# Altium schematic sheet LED_Controler.SchDoc: LED Shield - LED controllers
size A4; DrawnBy: Bronson Philippa; Revision: 1; SheetNumber: 2; SheetTotal: 2
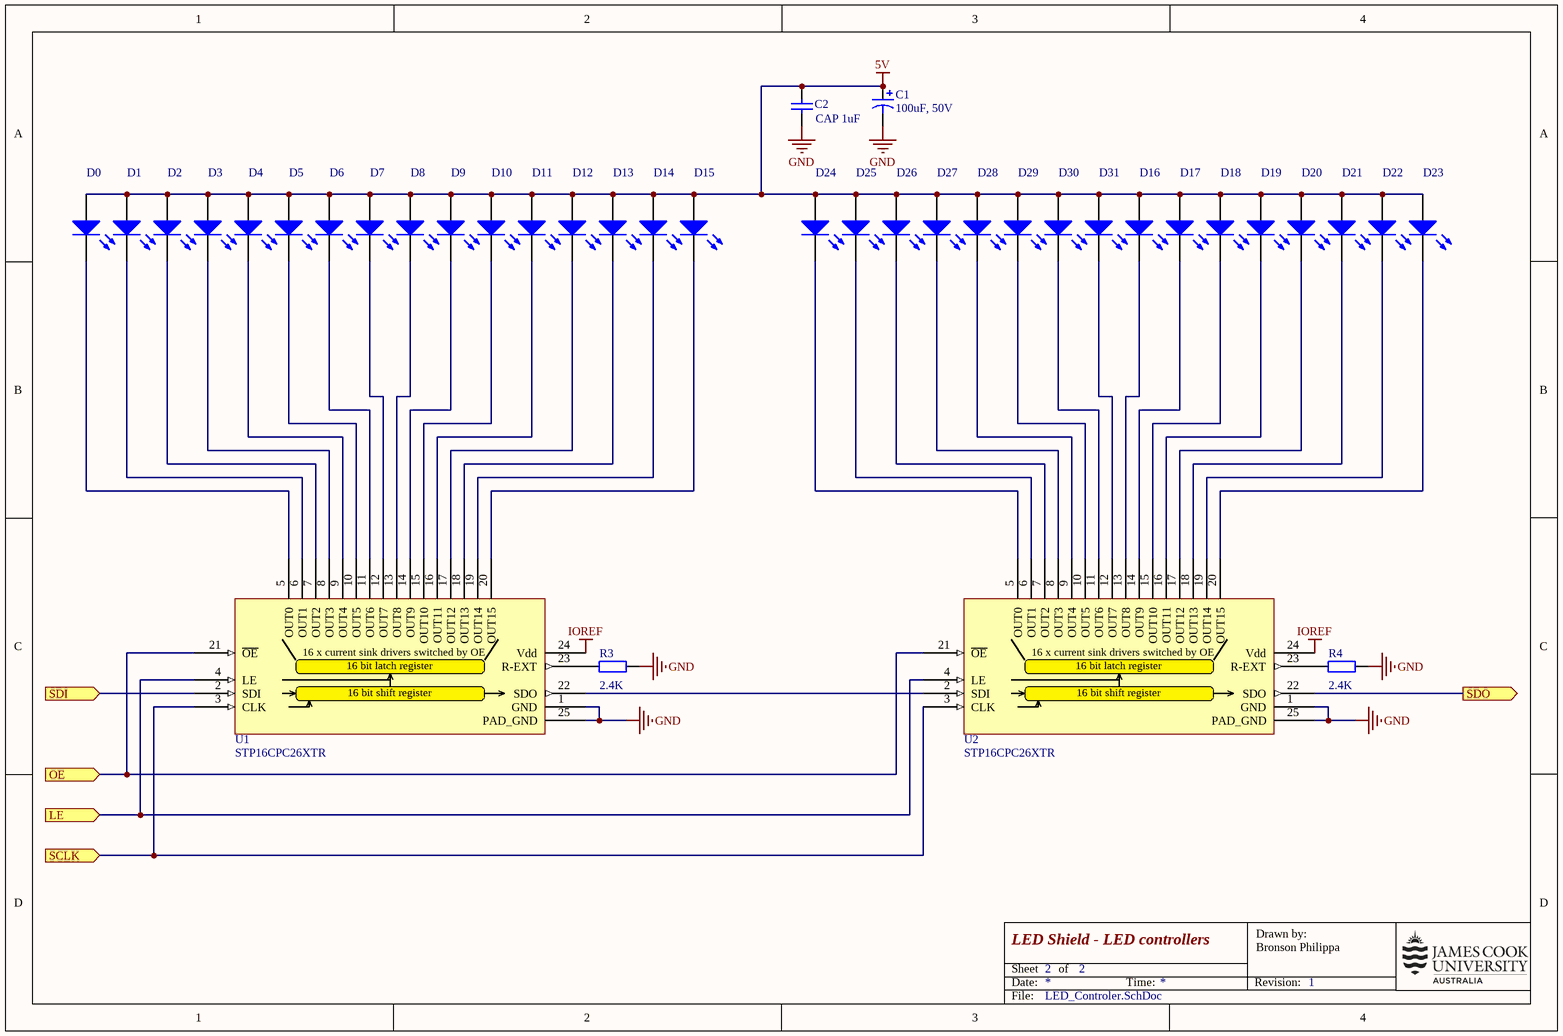
[diagram p0: LED_Controler.SchDoc]

## Parts
C1  100uF, 50V  [Capacitor radial 8mm]
C2  CAP 1uF  [CAPC1206(3216)130_M]
D0  LED3  [3.5X2.8X1.9]  (value not drawn)
D1  LED3  [3.5X2.8X1.9]  (value not drawn)
D2  LED3  [3.5X2.8X1.9]  (value not drawn)
D3  LED3  [3.5X2.8X1.9]  (value not drawn)
D4  LED3  [3.5X2.8X1.9]  (value not drawn)
D5  LED3  [3.5X2.8X1.9]  (value not drawn)
D6  LED3  [3.5X2.8X1.9]  (value not drawn)
D7  LED3  [3.5X2.8X1.9]  (value not drawn)
D8  LED3  [3.5X2.8X1.9]  (value not drawn)
D9  LED3  [3.5X2.8X1.9]  (value not drawn)
D10  LED3  [3.5X2.8X1.9]  (value not drawn)
D11  LED3  [3.5X2.8X1.9]  (value not drawn)
D12  LED3  [3.5X2.8X1.9]  (value not drawn)
D13  LED3  [3.5X2.8X1.9]  (value not drawn)
D14  LED3  [3.5X2.8X1.9]  (value not drawn)
D15  LED3  [3.5X2.8X1.9]  (value not drawn)
D16  LED3  [3.5X2.8X1.9]  (value not drawn)
D17  LED3  [3.5X2.8X1.9]  (value not drawn)
D18  LED3  [3.5X2.8X1.9]  (value not drawn)
D19  LED3  [3.5X2.8X1.9]  (value not drawn)
D20  LED3  [3.5X2.8X1.9]  (value not drawn)
D21  LED3  [3.5X2.8X1.9]  (value not drawn)
D22  LED3  [3.5X2.8X1.9]  (value not drawn)
D23  LED3  [3.5X2.8X1.9]  (value not drawn)
D24  LED3  [3.5X2.8X1.9]  (value not drawn)
D25  LED3  [3.5X2.8X1.9]  (value not drawn)
D26  LED3  [3.5X2.8X1.9]  (value not drawn)
D27  LED3  [3.5X2.8X1.9]  (value not drawn)
D28  LED3  [3.5X2.8X1.9]  (value not drawn)
D29  LED3  [3.5X2.8X1.9]  (value not drawn)
D30  LED3  [3.5X2.8X1.9]  (value not drawn)
D31  LED3  [3.5X2.8X1.9]  (value not drawn)
R3  value 2.4K  [AXIAL-0.4]  (hidden comment: Res2)
R4  value 2.4K  [AXIAL-0.4]  (hidden comment: Res2)
U1  STP16CPC26XTR  [STP16CPC26XTR TSSOP-24]
U2  STP16CPC26XTR  [STP16CPC26XTR TSSOP-24]

## Ports
LE (in), OE (in), SCLK (in), SDI (in), SDO (out)

## Nets
5V: C1.1 C2.1 D0.1(A) D1.1(A) D2.1(A) D3.1(A) D4.1(A) D5.1(A) D6.1(A) D7.1(A) D8.1(A) D9.1(A) D10.1(A) D11.1(A) D12.1(A) D13.1(A) D14.1(A) D15.1(A) D16.1(A) D17.1(A) D18.1(A) D19.1(A) D20.1(A) D21.1(A) D22.1(A) D23.1(A) D24.1(A) D25.1(A) D26.1(A) D27.1(A) D28.1(A) D29.1(A) D30.1(A) D31.1(A)
GND: C1.2 C2.2 R3.2 R4.2 U1.1(GND) U1.25(PAD_GND) U2.1(GND) U2.25(PAD_GND)
IOREF: U1.24(Vdd) U2.24(Vdd)
LE: U1.4(LE) U2.4(LE) ; port LE
OE: U1.21(~{OE}) U2.21(~{OE}) ; port OE
SCLK: U1.3(CLK) U2.3(CLK) ; port SCLK
SDI: U1.2(SDI) ; port SDI
SDO: U2.22(SDO) ; port SDO
NetD0_2: D0.2(K) U1.5(OUT0)
NetD1_2: D1.2(K) U1.6(OUT1)
NetD2_2: D2.2(K) U1.7(OUT2)
NetD3_2: D3.2(K) U1.8(OUT3)
NetD4_2: D4.2(K) U1.9(OUT4)
NetD5_2: D5.2(K) U1.10(OUT5)
NetD6_2: D6.2(K) U1.11(OUT6)
NetD7_2: D7.2(K) U1.12(OUT7)
NetD8_2: D8.2(K) U1.13(OUT8)
NetD9_2: D9.2(K) U1.14(OUT9)
NetD10_2: D10.2(K) U1.15(OUT10)
NetD11_2: D11.2(K) U1.16(OUT11)
NetD12_2: D12.2(K) U1.17(OUT12)
NetD13_2: D13.2(K) U1.18(OUT13)
NetD14_2: D14.2(K) U1.19(OUT14)
NetD15_2: D15.2(K) U1.20(OUT15)
NetD16_2: D16.2(K) U2.13(OUT8)
NetD17_2: D17.2(K) U2.14(OUT9)
NetD18_2: D18.2(K) U2.15(OUT10)
NetD19_2: D19.2(K) U2.16(OUT11)
NetD20_2: D20.2(K) U2.17(OUT12)
NetD21_2: D21.2(K) U2.18(OUT13)
NetD22_2: D22.2(K) U2.19(OUT14)
NetD23_2: D23.2(K) U2.20(OUT15)
NetD24_2: D24.2(K) U2.5(OUT0)
NetD25_2: D25.2(K) U2.6(OUT1)
NetD26_2: D26.2(K) U2.7(OUT2)
NetD27_2: D27.2(K) U2.8(OUT3)
NetD28_2: D28.2(K) U2.9(OUT4)
NetD29_2: D29.2(K) U2.10(OUT5)
NetD30_2: D30.2(K) U2.11(OUT6)
NetD31_2: D31.2(K) U2.12(OUT7)
NetR3_1: R3.1 U1.23(R-EXT)
NetR4_1: R4.1 U2.23(R-EXT)
NetU1_22: U1.22(SDO) U2.2(SDI)

## Notes on the sheet
- Date:
- Sheet
- of
- Time:
- Revision:
- Drawn by:
- File:
- (in symbol LED sink driver 16 ch STP16CPC26XTR) 16 x current sink drivers switched by OE; 16 bit latch register; 16 bit shift register

## Library data of the parts
C1 = Cap 100uF, 50V, THT radial: Electrolytic Capacitor, 100 µF, 50 V, ± 20%, Radial Leaded, 8 mm
C2 = CMP-1037-04700-1: CAP 1uF 25V ±10% 1206 (3216 Metric) Thickness 1.3mm SMD; Tolerance: Â±10%; Case-Metric: 3216; Case-EIA: 1206; Value: 1uF; Rated Voltage: 25 V; Max Thickness: 1.3 mm; Technology: SMT
D0-D31 = LED3: Typical BLUE SiC LED; Published: 8-Jun-2000; LatestRevisionDate: 17-Dec-2003; LatestRevisionNote: PCB Footprint replaced.; DatasheetVersion: 16-Apr-2002; PackageVersion: 16-Apr-2002; PackageReference: 3.5X2.8X1.9; Publisher: Altium Limited; PackageDescription: SM LED; 2 C-Bend Leads; Body 3.5 x 2.8 x 1.9 mm, inc leads (LxWxH typ)
R3 R4 = Res2: Resistor; Published: 8-Jun-2000; LatestRevisionDate: 17-Jul-2002; LatestRevisionNote: Re-released for DXP Platform.; PackageReference: AXIAL-0.4; Publisher: Altium Limited; PackageDescription: Axial Device, Thru-Hole; 2 Leads; 0.4 in Pin Spacing
U1 U2 = LED sink driver 16 ch STP16CPC26XTR: ST Microelectronics STP16CPC26XTR constant current LED sink driver; Supplier 1: element14 APAC; Supplier Part Number 1: 2460710; Supplier 2: Digikey; Supplier 3: Newark; Supplier Part Number 2: 497-11984-1-ND; Supplier Part Number 3: 38Y7958